# EAGLE schematic pcbqr_v4 (EAGLE 5.11)

## Sheet 1 of 2
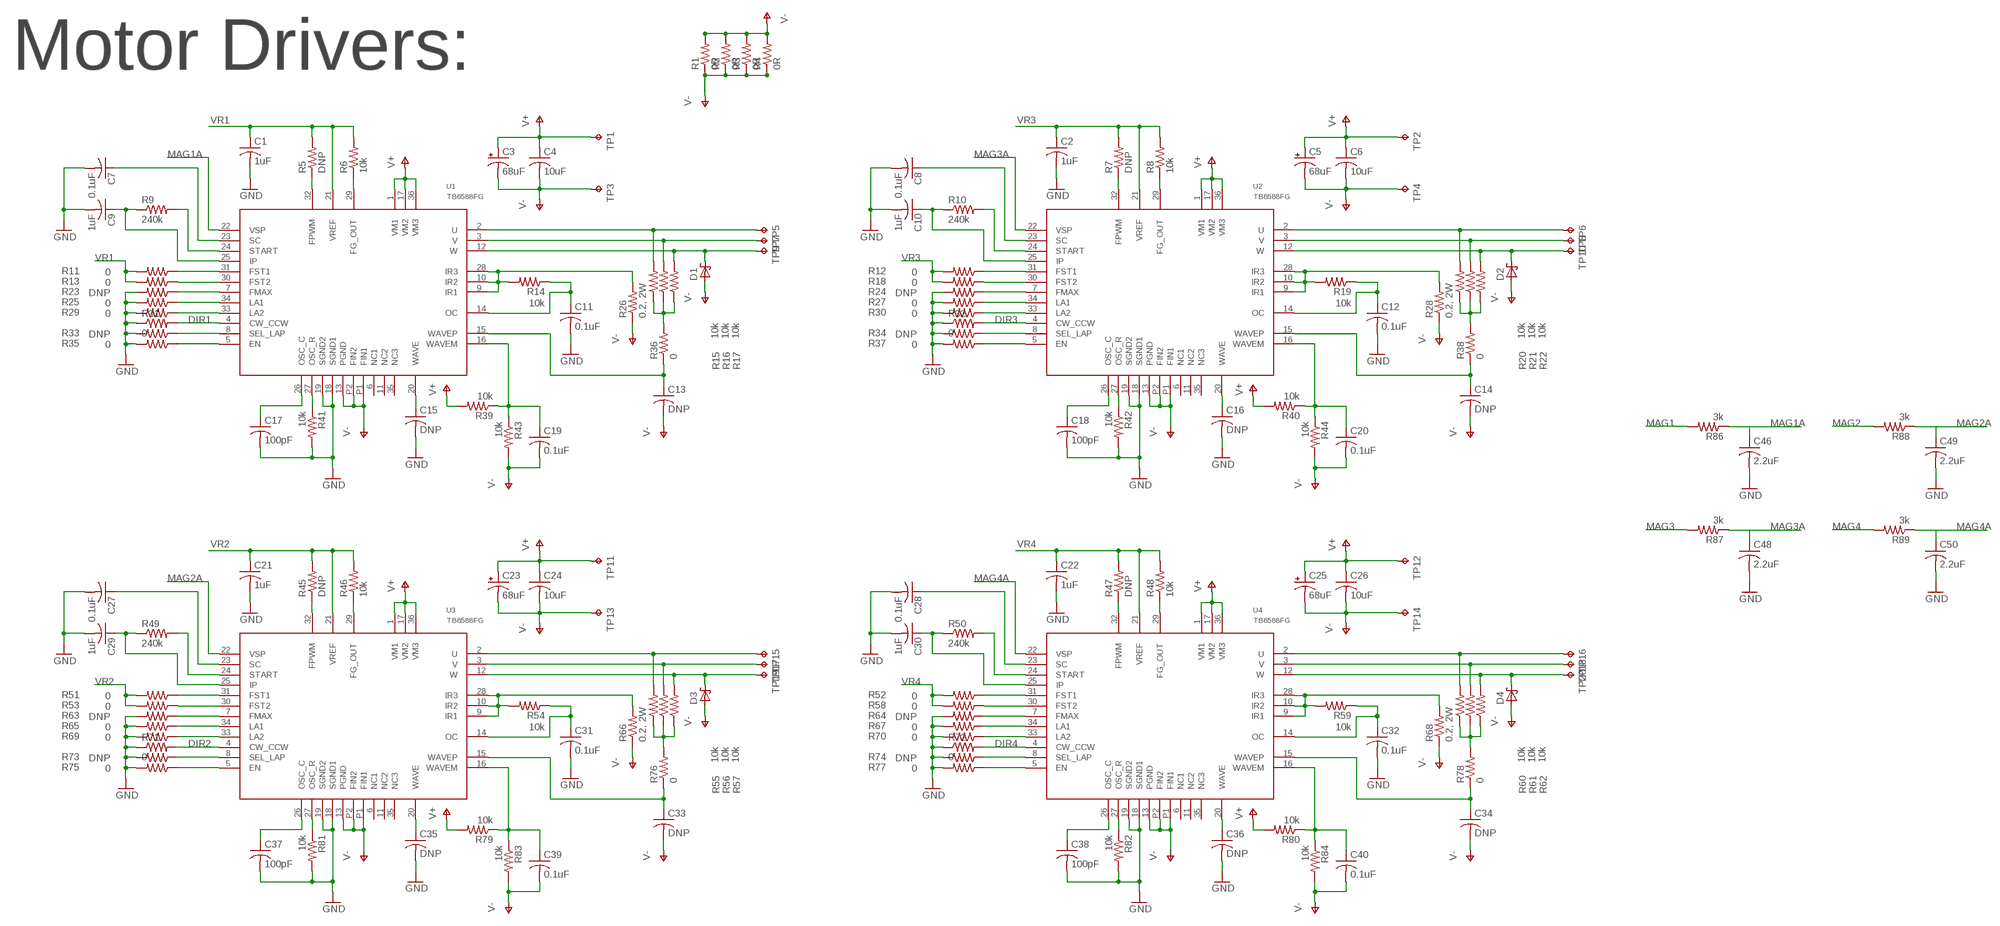
[diagram p0: schematic, sheet 1]

### Parts
C1  1uF  C-USC0603  [C0603]
C2  1uF  C-USC0603  [C0603]
C3  68uF  CPOL-USD  [PANASONIC_D]
C4  10uF  C-USC1206  [C1206]
C5  68uF  CPOL-USD  [PANASONIC_D]
C6  10uF  C-USC1206  [C1206]
C7  0.1uF  C-USC0603  [C0603]
C8  0.1uF  C-USC0603  [C0603]
C9  1uF  C-USC0603  [C0603]
C10  1uF  C-USC0603  [C0603]
C11  0.1uF  C-USC0603  [C0603]
C12  0.1uF  C-USC0603  [C0603]
C13  DNP  C-USC0603  [C0603]
C14  DNP  C-USC0603  [C0603]
C15  DNP  C-USC0603  [C0603]
C16  DNP  C-USC0603  [C0603]
C17  100pF  C-USC0603  [C0603]
C18  100pF  C-USC0603  [C0603]
C19  0.1uF  C-USC0603  [C0603]
C20  0.1uF  C-USC0603  [C0603]
C21  1uF  C-USC0603  [C0603]
C22  1uF  C-USC0603  [C0603]
C23  68uF  CPOL-USD  [PANASONIC_D]
C24  10uF  C-USC1206  [C1206]
C25  68uF  CPOL-USD  [PANASONIC_D]
C26  10uF  C-USC1206  [C1206]
C27  0.1uF  C-USC0603  [C0603]
C28  0.1uF  C-USC0603  [C0603]
C29  1uF  C-USC0603  [C0603]
C30  1uF  C-USC0603  [C0603]
C31  0.1uF  C-USC0603  [C0603]
C32  0.1uF  C-USC0603  [C0603]
C33  DNP  C-USC0603  [C0603]
C34  DNP  C-USC0603  [C0603]
C35  DNP  C-USC0603  [C0603]
C36  DNP  C-USC0603  [C0603]
C37  100pF  C-USC0603  [C0603]
C38  100pF  C-USC0603  [C0603]
C39  0.1uF  C-USC0603  [C0603]
C40  0.1uF  C-USC0603  [C0603]
C46  2.2uF  C-USC0603  [C0603]
C48  2.2uF  C-USC0603  [C0603]
C49  2.2uF  C-USC0603  [C0603]
C50  2.2uF  C-USC0603  [C0603]
D1  SCHOTTKY_SMA  [SMA]
D2  SCHOTTKY_SMA  [SMA]
D3  SCHOTTKY_SMA  [SMA]
D4  SCHOTTKY_SMA  [SMA]
R1  0R  R-US_R1210  [R1210]
R2  0R  R-US_R1210  [R1210]
R3  0R  R-US_R2010  [R2010]
R4  0R  R-US_R2010  [R2010]
R5  DNP  R-US_R0603  [R0603]
R6  10k  R-US_R0603  [R0603]
R7  DNP  R-US_R0603  [R0603]
R8  10k  R-US_R0603  [R0603]
R9  240k  R-US_R0603  [R0603]
R10  240k  R-US_R0603  [R0603]
R11  0  R-US_R0603  [R0603]
R12  0  R-US_R0603  [R0603]
R13  0  R-US_R0603  [R0603]
R14  10k  R-US_R0603  [R0603]
R15  10k  R-US_R0603  [R0603]
R16  10k  R-US_R0603  [R0603]
R17  10k  R-US_R0603  [R0603]
R18  0  R-US_R0603  [R0603]
R19  10k  R-US_R0603  [R0603]
R20  10k  R-US_R0603  [R0603]
R21  10k  R-US_R0603  [R0603]
R22  10k  R-US_R0603  [R0603]
R23  DNP  R-US_R0603  [R0603]
R24  DNP  R-US_R0603  [R0603]
R25  0  R-US_R0603  [R0603]
R26  0.2, 2W  R-US_R2512  [R2512]
R27  0  R-US_R0603  [R0603]
R28  0.2, 2W  R-US_R2512  [R2512]
R29  0  R-US_R0603  [R0603]
R30  0  R-US_R0603  [R0603]
R31  0  R-US_R0603  [R0603]
R32  0  R-US_R0603  [R0603]
R33  DNP  R-US_R0603  [R0603]
R34  DNP  R-US_R0603  [R0603]
R35  0  R-US_R0603  [R0603]
R36  0  R-US_R0603  [R0603]
R37  0  R-US_R0603  [R0603]
R38  0  R-US_R0603  [R0603]
R39  10k  R-US_R0603  [R0603]
R40  10k  R-US_R0603  [R0603]
R41  10k  R-US_R0603  [R0603]
R42  10k  R-US_R0603  [R0603]
R43  10k  R-US_R0603  [R0603]
R44  10k  R-US_R0603  [R0603]
R45  DNP  R-US_R0603  [R0603]
R46  10k  R-US_R0603  [R0603]
R47  DNP  R-US_R0603  [R0603]
R48  10k  R-US_R0603  [R0603]
R49  240k  R-US_R0603  [R0603]
R50  240k  R-US_R0603  [R0603]
R51  0  R-US_R0603  [R0603]
R52  0  R-US_R0603  [R0603]
R53  0  R-US_R0603  [R0603]
R54  10k  R-US_R0603  [R0603]
R55  10k  R-US_R0603  [R0603]
R56  10k  R-US_R0603  [R0603]
R57  10k  R-US_R0603  [R0603]
R58  0  R-US_R0603  [R0603]
R59  10k  R-US_R0603  [R0603]
R60  10k  R-US_R0603  [R0603]
R61  10k  R-US_R0603  [R0603]
R62  10k  R-US_R0603  [R0603]
R63  DNP  R-US_R0603  [R0603]
R64  DNP  R-US_R0603  [R0603]
R65  0  R-US_R0603  [R0603]
R66  0.2, 2W  R-US_R2512  [R2512]
R67  0  R-US_R0603  [R0603]
R68  0.2, 2W  R-US_R2512  [R2512]
R69  0  R-US_R0603  [R0603]
R70  0  R-US_R0603  [R0603]
R71  0  R-US_R0603  [R0603]
R72  0  R-US_R0603  [R0603]
R73  DNP  R-US_R0603  [R0603]
R74  DNP  R-US_R0603  [R0603]
R75  0  R-US_R0603  [R0603]
R76  0  R-US_R0603  [R0603]
R77  0  R-US_R0603  [R0603]
R78  0  R-US_R0603  [R0603]
R79  10k  R-US_R0603  [R0603]
R80  10k  R-US_R0603  [R0603]
R81  10k  R-US_R0603  [R0603]
R82  10k  R-US_R0603  [R0603]
R83  10k  R-US_R0603  [R0603]
R84  10k  R-US_R0603  [R0603]
R86  3k  RESISTOR0805-RES  [0805]
R87  3k  RESISTOR0805-RES  [0805]
R88  3k  RESISTOR0805-RES  [0805]
R89  3k  RESISTOR0805-RES  [0805]
TP1  TPTP20SQ  [TP20SQ]
TP2  TPTP20SQ  [TP20SQ]
TP3  TPTP20SQ  [TP20SQ]
TP4  TPTP20SQ  [TP20SQ]
TP5  TPTP20SQ  [TP20SQ]
TP6  TPTP20SQ  [TP20SQ]
TP7  TPTP20SQ  [TP20SQ]
TP8  TPTP20SQ  [TP20SQ]
TP9  TPTP20SQ  [TP20SQ]
TP10  TPTP20SQ  [TP20SQ]
TP11  TPTP20SQ  [TP20SQ]
TP12  TPTP20SQ  [TP20SQ]
TP13  TPTP20SQ  [TP20SQ]
TP14  TPTP20SQ  [TP20SQ]
TP15  TPTP20SQ  [TP20SQ]
TP16  TPTP20SQ  [TP20SQ]
TP17  TPTP20SQ  [TP20SQ]
TP18  TPTP20SQ  [TP20SQ]
TP19  TPTP20SQ  [TP20SQ]
TP20  TPTP20SQ  [TP20SQ]
U1  TB6588FG  [HSOP36-P-450-0.65]
U2  TB6588FG  [HSOP36-P-450-0.65]
U3  TB6588FG  [HSOP36-P-450-0.65]
U4  TB6588FG  [HSOP36-P-450-0.65]

### Nets
DIR1: R31.2 U1.4(CW_CCW)
DIR2: R71.2 U3.4(CW_CCW)
DIR3: R32.2 U2.4(CW_CCW)
DIR4: R72.2 U4.4(CW_CCW)
GND: C1.2 C2.2 C7.2 C8.2 C9.2 C10.2 C11.2 C12.2 C15.2 C16.2 C17.2 C18.2 C21.2 C22.2 C27.2 C28.2 C29.2 C30.2 C31.2 C32.2 C35.2 C36.2 C37.2 C38.2 C46.2 C48.2 C49.2 C50.2 R23.2 R24.2 R25.2 R27.2 R29.2 R30.2 R31.1 R32.1 R33.2 R34.2 R35.2 R37.2 R41.2 R42.2 R63.2 R64.2 R65.2 R67.2 R69.2 R70.2 R71.1 R72.1 R73.2 R74.2 R75.2 R77.2 R81.2 R82.2 U1.18(SGND1) U1.19(SGND2) U2.18(SGND1) U2.19(SGND2) U3.18(SGND1) U3.19(SGND2) U4.18(SGND1) U4.19(SGND2) ; also sheet 2
MAG1: R86.2 ; also sheet 2
MAG1A: C46.1 R86.1 U1.22(VSP)
MAG2: R88.2 ; also sheet 2
MAG2A: C49.1 R88.1 U3.22(VSP)
MAG3: R87.2 ; also sheet 2
MAG3A: C48.1 R87.1 U2.22(VSP)
MAG4: R89.2 ; also sheet 2
MAG4A: C50.1 R89.1 U4.22(VSP)
N$3: R15.1 R16.1 R17.1 R36.2
N$4: R14.2 R26.2 U1.9(IR1) U1.10(IR2) U1.28(IR3)
N$5: R15.2 TP5.TP U1.2(U)
N$6: R16.2 TP7.TP U1.3(V)
N$7: D1.C R17.2 TP9.TP U1.12(W)
N$8: R35.1 U1.5(EN)
N$9: R33.1 U1.8(SEL_LAP)
N$10: R9.2 U1.24(START)
N$11: R29.1 U1.33(LA2)
N$12: R25.1 U1.34(LA1)
N$13: R23.1 U1.7(FMAX)
N$14: C17.1 U1.26(OSC_C)
N$15: R41.1 U1.27(OSC_R)
N$16: R13.1 U1.30(FST2)
N$17: R11.1 U1.31(FST1)
N$18: C9.1 R9.1 U1.25(IP)
N$19: R5.1 U1.32(FPWM)
N$20: C7.1 U1.23(SC)
N$21: R6.1 U1.29(FG_OUT)
N$22: C19.1 R39.1 R43.1 U1.16(WAVEM)
N$23: R54.2 R66.2 U3.9(IR1) U3.10(IR2) U3.28(IR3)
N$24: C13.1 R36.1 U1.15(WAVEP)
N$25: C11.1 R14.1 U1.14(OC)
N$26: C15.1 U1.20(WAVE)
N$27: R55.2 TP15.TP U3.2(U)
N$28: R56.2 TP17.TP U3.3(V)
N$29: D3.C R57.2 TP19.TP U3.12(W)
N$30: R75.1 U3.5(EN)
N$31: R73.1 U3.8(SEL_LAP)
N$32: R69.1 U3.33(LA2)
N$33: R65.1 U3.34(LA1)
N$34: R63.1 U3.7(FMAX)
N$35: C37.1 U3.26(OSC_C)
N$36: R81.1 U3.27(OSC_R)
N$37: R53.1 U3.30(FST2)
N$38: R51.1 U3.31(FST1)
N$39: R49.2 U3.24(START)
N$40: C29.1 R49.1 U3.25(IP)
N$41: C27.1 U3.23(SC)
N$42: R45.1 U3.32(FPWM)
N$43: R46.1 U3.29(FG_OUT)
N$44: R55.1 R56.1 R57.1 R76.2
N$45: C33.1 R76.1 U3.15(WAVEP)
N$46: C31.1 R54.1 U3.14(OC)
N$47: C39.1 R79.1 R83.1 U3.16(WAVEM)
N$48: C35.1 U3.20(WAVE)
N$49: R19.2 R28.2 U2.9(IR1) U2.10(IR2) U2.28(IR3)
N$50: R20.2 TP6.TP U2.2(U)
N$51: R21.2 TP8.TP U2.3(V)
N$52: D2.C R22.2 TP10.TP U2.12(W)
N$53: R37.1 U2.5(EN)
N$54: R34.1 U2.8(SEL_LAP)
N$55: R30.1 U2.33(LA2)
N$56: R27.1 U2.34(LA1)
N$57: R24.1 U2.7(FMAX)
N$58: C18.1 U2.26(OSC_C)
N$59: R42.1 U2.27(OSC_R)
N$60: R18.1 U2.30(FST2)
N$61: R12.1 U2.31(FST1)
N$62: R10.2 U2.24(START)
N$63: C10.1 R10.1 U2.25(IP)
N$64: C8.1 U2.23(SC)
N$65: R7.1 U2.32(FPWM)
N$66: R8.1 U2.29(FG_OUT)
N$67: R20.1 R21.1 R22.1 R38.2
N$68: C14.1 R38.1 U2.15(WAVEP)
N$69: C12.1 R19.1 U2.14(OC)
N$70: C20.1 R40.1 R44.1 U2.16(WAVEM)
N$71: C16.1 U2.20(WAVE)
N$72: R59.2 R68.2 U4.9(IR1) U4.10(IR2) U4.28(IR3)
N$73: R60.2 TP16.TP U4.2(U)
N$74: R61.2 TP18.TP U4.3(V)
N$75: D4.C R62.2 TP20.TP U4.12(W)
N$76: R77.1 U4.5(EN)
N$77: R74.1 U4.8(SEL_LAP)
N$78: R70.1 U4.33(LA2)
N$79: R67.1 U4.34(LA1)
N$80: R64.1 U4.7(FMAX)
N$81: C38.1 U4.26(OSC_C)
N$82: R82.1 U4.27(OSC_R)
N$83: R58.1 U4.30(FST2)
N$84: R52.1 U4.31(FST1)
N$85: R50.2 U4.24(START)
N$86: C30.1 R50.1 U4.25(IP)
N$87: C28.1 U4.23(SC)
N$88: R47.1 U4.32(FPWM)
N$89: R48.1 U4.29(FG_OUT)
N$90: R60.1 R61.1 R62.1 R78.2
N$91: C34.1 R78.1 U4.15(WAVEP)
N$92: C32.1 R59.1 U4.14(OC)
N$93: C40.1 R80.1 R84.1 U4.16(WAVEM)
N$94: C36.1 U4.20(WAVE)
V+: C3.+ C4.1 C5.+ C6.1 C23.+ C24.1 C25.+ C26.1 R39.2 R40.2 R79.2 R80.2 TP1.TP TP2.TP TP11.TP TP12.TP U1.1(VM1) U1.17(VM2) U1.36(VM3) U2.1(VM1) U2.17(VM2) U2.36(VM3) U3.1(VM1) U3.17(VM2) U3.36(VM3) U4.1(VM1) U4.17(VM2) U4.36(VM3) ; also sheet 2
V-: C3.- C4.2 C5.- C6.2 C13.2 C14.2 C19.2 C20.2 C23.- C24.2 C25.- C26.2 C33.2 C34.2 C39.2 C40.2 D1.A D2.A D3.A D4.A R1.1 R1.2 R2.1 R2.2 R3.1 R3.2 R4.1 R4.2 R26.1 R28.1 R43.2 R44.2 R66.1 R68.1 R83.2 R84.2 TP3.TP TP4.TP TP13.TP TP14.TP U1.13(PGND) U1.P1(FIN1) U1.P2(FIN2) U2.13(PGND) U2.P1(FIN1) U2.P2(FIN2) U3.13(PGND) U3.P1(FIN1) U3.P2(FIN2) U4.13(PGND) U4.P1(FIN1) U4.P2(FIN2) ; also sheet 2
VR1: C1.1 R5.2 R6.2 R11.2 R13.2 U1.21(VREF)
VR2: C21.1 R45.2 R46.2 R51.2 R53.2 U3.21(VREF)
VR3: C2.1 R7.2 R8.2 R12.2 R18.2 U2.21(VREF)
VR4: C22.1 R47.2 R48.2 R52.2 R58.2 U4.21(VREF)
Unconnected: U1.6(NC1) U1.11(NC2) U1.35(NC3) U2.6(NC1) U2.11(NC2) U2.35(NC3) U3.6(NC1) U3.11(NC2) U3.35(NC3) U4.6(NC1) U4.11(NC2) U4.35(NC3)

### Notes on the sheet
- Motor Drivers:

## Sheet 2 of 2
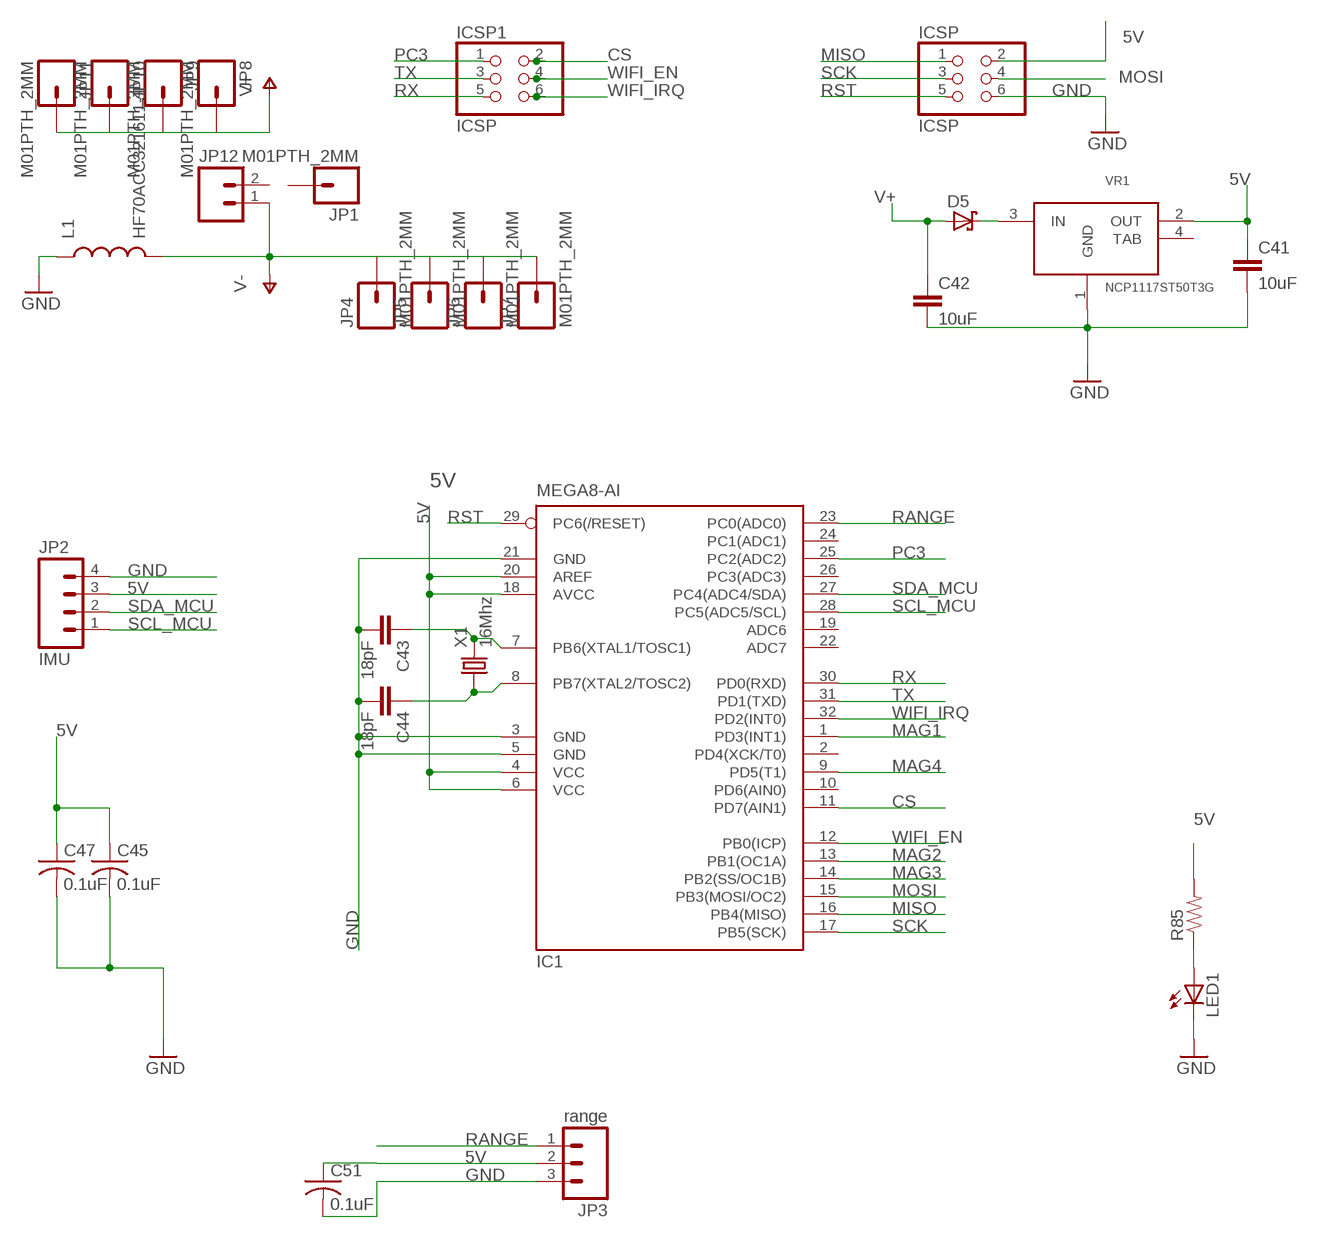
[diagram p1: schematic, sheet 2]

### Parts
C41  10uF  CAP0805  [0805]
C42  10uF  CAP0805  [0805]
C43  18pF  CAP0805  [0805]
C44  18pF  CAP0805  [0805]
C45  0.1uF  C-USC0603  [C0603]
C47  0.1uF  C-USC0603  [C0603]
C51  0.1uF  C-USC0603  [C0603]
D5  SCHOTTKY_SMA  [SMA]
IC1  MEGA8-AI  [TQFP32-08]
ICSP  ICSP  PINHD-2X3  [2X03]
ICSP1  ICSP  PINHD-2X3  [2X03]
JP1  M01PTH_2MM  [1X01_2MM]
JP2  IMU  M04PTH  [1X04]
JP3  range  M03POLAR  [MOLEX-1X3]
JP4  M01PTH_2MM  [1X01_2MM]
JP5  M01PTH_2MM  [1X01_2MM]
JP6  M01PTH_2MM  [1X01_2MM]
JP7  M01PTH_2MM  [1X01_2MM]
JP8  M01PTH_2MM  [1X01_2MM]
JP9  M01PTH_2MM  [1X01_2MM]
JP10  M01PTH_2MM  [1X01_2MM]
JP11  M01PTH_2MM  [1X01_2MM]
JP12  M02PTH4  [1X02_XTRA_BIG]
L1  HF70ACC321611-T  INDUCTOR1206H*  [INDUCTOR-1206]
LED1  LEDCHIPLED_1206  [CHIPLED_1206]
R85  RESISTOR0805-RES  [0805]
VR1  NCP1117ST50T3G  LM1117  [SOT-223]
X1  16Mhz  CRYSTAL-5032  [5032]

### Nets
5V: C41.1 C45.1 C47.1 C51.1 IC1.4(VCC) IC1.6(VCC) IC1.18(AVCC) IC1.20(AREF) ICSP.2 JP2.3 JP3.2 R85.2 VR1.2(OUT)
CS: IC1.11(PD7(AIN1)) ICSP1.2
GND: C41.2 C42.2 C43.2 C44.2 C45.2 C47.2 C51.2 IC1.3(GND) IC1.5(GND) IC1.21(GND) ICSP.6 JP2.4 JP3.3 L1.P$1 LED1.C VR1.1(GND) ; also sheet 1
MAG1: IC1.1(PD3(INT1)) ; also sheet 1
MAG2: IC1.13(PB1(OC1A)) ; also sheet 1
MAG3: IC1.14(PB2(SS/OC1B)) ; also sheet 1
MAG4: IC1.9(PD5(T1)) ; also sheet 1
MISO: IC1.16(PB4(MISO)) ICSP.1
MOSI: IC1.15(PB3(MOSI/OC2)) ICSP.4
N$1: LED1.A R85.1
N$2: C43.1 IC1.7(PB6(XTAL1/TOSC1)) X1.2
N$95: C44.1 IC1.8(PB7(XTAL2/TOSC2)) X1.1
N$96: D5.C VR1.3(IN)
PC3: IC1.25(PC2(ADC2)) ICSP1.1
RANGE: IC1.23(PC0(ADC0)) JP3.1
RST: IC1.29(PC6(/RESET)) ICSP.5
RX: IC1.30(PD0(RXD)) ICSP1.5
SCK: IC1.17(PB5(SCK)) ICSP.3
SCL_MCU: IC1.28(PC5(ADC5/SCL)) JP2.1
SDA_MCU: IC1.27(PC4(ADC4/SDA)) JP2.2
TX: IC1.31(PD1(TXD)) ICSP1.3
V+: C42.1 D5.A JP8.1 JP9.1 JP10.1 JP11.1 ; also sheet 1
V-: JP4.1 JP5.1 JP6.1 JP7.1 JP12.1 L1.P$2 ; also sheet 1
WIFI_EN: IC1.12(PB0(ICP)) ICSP1.4
WIFI_IRQ: IC1.32(PD2(INT0)) ICSP1.6
Unconnected: IC1.2(PD4(XCK/T0)) IC1.10(PD6(AIN0)) IC1.19(ADC6) IC1.22(ADC7) IC1.24(PC1(ADC1)) IC1.26(PC3(ADC3)) JP1.1 JP12.2 VR1.4(TAB)

## Library data of the parts
C1 C2 C4 C6-C22 C24 C26-C40 C45-C51 = rcl:C-US: CAPACITOR, American symbol
C3 C5 C23 C25 = rcl:CPOL-US: POLARIZED CAPACITOR, American symbol
C41 C42 = SparkFun:CAP: Capacitor Standard 0603 ceramic capacitor, and 0.1" leaded capacitor.
C43 C44 = slice_noshift:CAP: Capacitor Standard 0603 ceramic capacitor, and 0.1" leaded capacitor.
D1-D5 = sc_usercreated:SCHOTTKY_SMA
IC1 = atmel:MEGA8: MICROCONTROLLER 8 Kbytes FLASH, 1 kbytes SRAM, 512 bytes EEPROM, USART, 6-channel 10 bit ADC, 2-channel 8 bit ADC Pin compatible with Atmega48, ATMega88, ATMega168 Source: avr.lbr; MPN: ATMEGA8-16AU; OC_FARNELL: 9171371; OC_NEWARK: 73M8863
ICSP ICSP1 = pinhead:PINHD-2X3: PIN HEADER
JP1 JP4-JP11 = SparkFun:M01: Header 1 Standard 1-pin 0.1" header. Use with straight break away headers (SKU : PRT-00116), right angle break away headers (PRT-00553), swiss pins (PRT-00743), machine pins (PRT-00117), and female headers (PRT-00115).
JP2 = SparkFun:M04: Header 4 Standard 4-pin 0.1" header. Use with straight break away headers (SKU : PRT-00116), right angle break away headers (PRT-00553), swiss pins (PRT-00743), machine pins (PRT-00117), and female headers (PRT-00115). Molex polarized connector foot print use with SKU : PRT-08231 with associated crimp pins and housings. 1MM SMD Version SKU: PRT-10208
JP3 = SparkFun:M03: Header 3 Standard 3-pin 0.1" header. Use with straight break away headers (SKU : PRT-00116), right angle break away headers (PRT-00553), swiss pins (PRT-00743), machine pins (PRT-00117), and female headers (PRT-00115). Molex polarized connector foot print use with SKU : PRT-08232 with associated crimp pins and housings.
JP12 = SparkFun:M02: Header 2 Standard 2-pin 0.1" header. Use with straight break away headers (SKU : PRT-00116), right angle break away headers (PRT-00553), swiss pins (PRT-00743), machine pins (PRT-00117), and female headers (PRT-00115). Molex polarized connector foot print use with SKU : PRT-08233 with associated crimp pins and housings.
L1 = SparkFun:INDUCTOR: Inductors Basic Inductor/Choke - 0603 and 1206. Footprints are not proven and vary greatly between part numbers.
LED1 = led:LED: LED OSRAM: - CHIPLED LG R971, LG N971, LY N971, LG Q971, LY Q971, LO R971, LY R971 LH N974, LH R974 LS Q976, LO Q976, LY Q976 LO Q996 - Hyper CHIPLED LW Q18S LB Q993, LB Q99A, LB R99A - SideLED LS A670, LO A670, LY A670, LG A670, LP A670 LB A673, LV A673, LT A673, LW A673 LH A674 LY A675 LS A676, LA A676, LO A676, LY A676, LW A676 LS A679, LY A679, LG A679 - Hyper Micro SIDELED® LS Y876, LA Y876, LO Y876, LY Y876 LT Y87S - SmartLED LW L88C, LW L88S LB L89C, LB L89S, LG L890 LS L89K, LO L89K, LY L89K LS L896, LA L896, LO L896, LY L896 - TOPLED LS T670, LO T670, LY T670, LG T670, LP T670 LSG T670, LSP T670, LSY T670, LOP T670, LYG T670 LG T671, LOG T671, LSG T671 LB T673, LV T673, LT T673, LW T673 LH T674 LS T676, LA T676, LO T676, LY T676, LB T676, LH T676, LSB T676, LW T676 LB T67C, LV T67C, LT T67C, LS T67K, LO T67K, LY T67K, LW E67C LS E67B, LA E67B, LO E67B, LY E67B, LB E67C, LV E67C, LT E67C LW T67C LS T679, LY T679, LG T679 LS T770, LO T770, LY T770, LG T770, LP T770 LB T773, LV T773, LT T773, LW T773 LH T774 LS E675, LA E675, LY E675, LS T675 LS T776, LA T776, LO T776, LY T776, LB T776 LHGB T686 LT T68C, LB T68C - Hyper Mini TOPLED® LB M676 - Mini TOPLED Santana® LG M470 LS M47K, LO M47K, LY M47K Source: http://www.osram.convergy.de LUXEON: - LUMILED® LXK2-PW12-R00, LXK2-PW12-S00, LXK2-PW14-U00, LXK2-PW14-V00 LXK2-PM12-R00, LXK2-PM12-S00, LXK2-PM14-U00 LXK2-PE12-Q00, LXK2-PE12-R00, LXK2-PE12-S00, LXK2-PE14-T00, LXK2-PE14-U00 LXK2-PB12-K00, LXK2-PB12-L00, LXK2-PB12-M00, LXK2-PB14-N00, LXK2-PB14-P00, LXK2-PB14-Q00 LXK2-PR12-L00, LXK2-PR12-M00, LXK2-PR14-Q00, LXK2-PR14-R00 LXK2-PD12-Q00, LXK2-PD12-R00, LXK2-PD12-S00 LXK2-PH12-R00, LXK2-PH12-S00 LXK2-PL12-P00, LXK2-PL12-Q00, LXK2-PL12-R00 Source: www.luxeon.com KINGBRIGHT: KA-3528ASYC Source: www.kingbright.com
R1-R84 = rcl:R-US_: RESISTOR, American symbol
R85-R89 = SparkFun:RESISTOR: Resistor Basic schematic elements and footprints for 0603, 1206, and PTH resistors.
TP1-TP20 = testpad:TP: Test pad
U1-U4 = sc_usercreated:TB6588FG
VR1 = sc_usercreated:LM1117
X1 = NSL_MiniQuad:CRYSTAL*: CRYSTAL

## Net classes
0 default: width 0.203 mm, drill 0.381 mm, clearance 0.203 mm
1 power: width 0.254 mm, drill 0.381 mm, clearance 0.203 mm
3 usbvcc: width 0.508 mm, drill 0.381 mm, clearance 0.203 mm